# Altium schematic sheet LoRaWAN.SchDoc
size A3
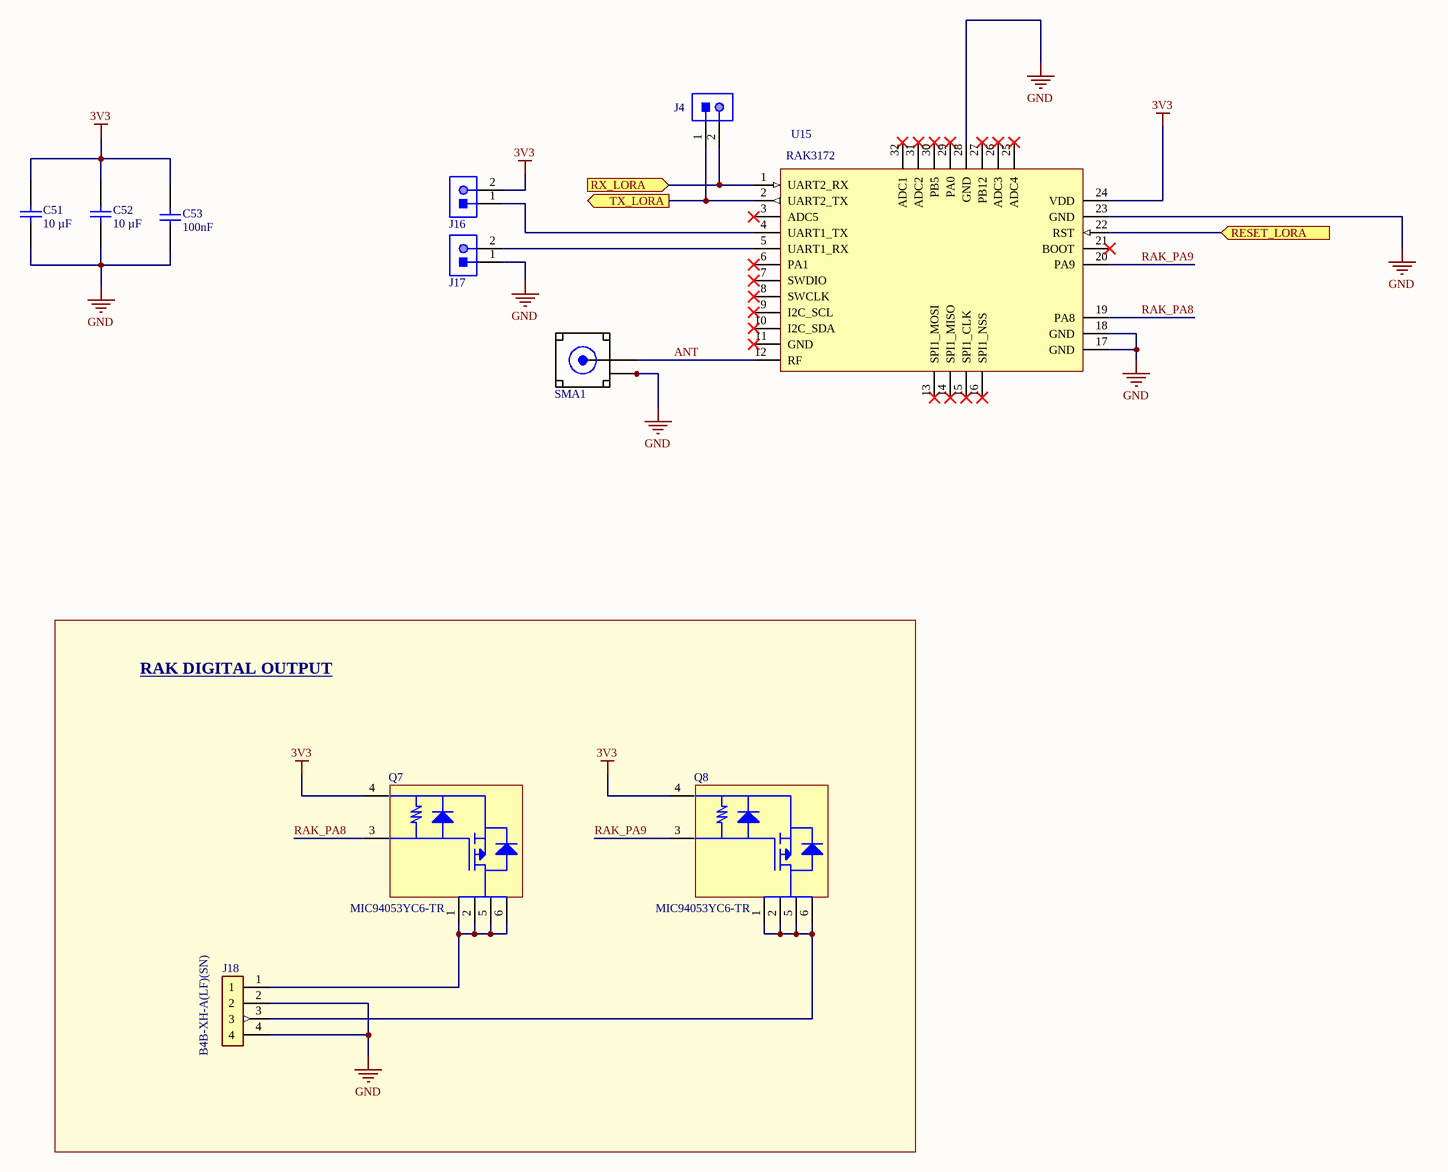
[diagram p0: LoRaWAN.SchDoc]

## Parts
C51  10 µF  [Cap 0805 (2012 Metric)]
C52  10 µF  [Cap 0805 (2012 Metric)]
C53  100nF  [Cap 0805 (2012 Metric)]
J4  Header 2x1  [Header 2x1]  (value not drawn)
J16  Header 2x1  [Header 2x1]  (value not drawn)
J17  Header 2x1  [Header 2x1]  (value not drawn)
J18  B4B-XH-A(LF)(SN)  [B4B-XH-A(LF)(SN)]
Q7  MIC94053YC6-TR  [SC-70-6]
Q8  MIC94053YC6-TR  [SC-70-6]
SMA1  https://www.digikey.com/products/en?keywords=5-1814400-1  [5-1814400-1+ant]  (value not drawn)
U15  RAK3172  [RAK3172]

## Blocks framed on the sheet
RAK DIGITAL OUTPUT: J18 Q7 Q8

## Ports
RESET_LORA (in), RX_LORA (in), TX_LORA (out)

## Nets
3V3: C51.1 C52.1 C53.1 J16.2 Q7.4(S) Q8.4(S) U15.24(VDD)
GND: C51.2 C52.2 C53.2 J17.1 J18.2 J18.4 SMA1.1(GND) SMA1.2(GND) SMA1.3(GND) SMA1.4(GND) U15.17(GND) U15.18(GND) U15.23(GND) U15.28(GND)
ANT: SMA1.5(SIGNAL) U15.12(RF)
RAK_PA8: Q7.3(G) U15.19(PA8)
RAK_PA9: Q8.3(G) U15.20(PA9)
RESET_LORA: U15.22(RST) ; port RESET_LORA
RX_LORA: J4.2 U15.1(UART2_RX) ; port RX_LORA
TX_LORA: J4.1 U15.2(UART2_TX) ; port TX_LORA
NetJ16_1: J16.1 U15.4(UART1_TX)
NetJ17_2: J17.2 U15.5(UART1_RX)
NetJ18_1: J18.1 Q7.1(D) Q7.2(D) Q7.5(D) Q7.6(D)
NetJ18_3: J18.3 Q8.1(D) Q8.2(D) Q8.5(D) Q8.6(D)

Not connected (* = marked no-connect by the designer): U15 3(ADC5)* 6(PA1)* 7(SWDIO)* 8(SWCLK)* 9(I2C_SCL)* 10(I2C_SDA)* 11(GND)* 13(SPI1_MOSI)* 14(SPI1_MISO)* 15(SPI1_CLK)* 16(SPI1_NSS)* 21(BOOT)* 25(ADC4)* 26(ADC3)* 27(PB12)* 29(PA0)* 30(PB5)* 31(ADC2)* 32(ADC1)*

## Library data of the parts
C51 C52 = Capacitor: 10 µF ±10% 10V Ceramic Capacitor X5R 0805 (2012 Metric); Manufacturer: Cal-Chip Electronics; Manufacturer Part Number: GMC21X5R106K10NT; Link: https://www.digikey.com/en/products/detail/cal-chip-electronics-inc/GMC21X5R106K10NT/13970195; Supplier 1: Digi-Key; Supplier Part Number 1: 66925-507LF-ND; RoHS: Yes; Capacitance: 10 µF
C53 = Capacitor: Cap Ceramic 0.1uF 50V X7R 10% Pad SMD 0805 125C Automotive T/R; Manufacturer: Samsung; Manufacturer Part Number: CL21B104KBC5PNL; Link: https://www.digikey.com/es/products/detail/samsung-electro-mechanics/CL21B104KBC5PNL/7320505?s=N4IgTCBcDaIMIBkwEYBCyAMAWA0quArAAoByCIAugL5A; Supplier 1: Digi-Key; Supplier Part Number 1: 1276-7000-1-ND; RoHS: Yes; Category: Ceramic Capacitors; Stock 1: 163447; Pricing 1: 1=0,26000, 10=0,18000, 50=0,10820, 100=0,09140, 500=0,06254, 1000=0,05533, 2500=0,05292, 5000=0,04811 (USD); Mount: Surface Mount; Case/Package: 0805; Min Operating Temperature: -55°C; Max Operating Temperature: 125°C; Capacitance: 100nF; Tolerance: 10%; Dielectric: X7R; Packaging: Tape and Reel; Voltage: 50V; Series: CL; Length: 2mm; Height: 0.85mm; Depth: 1.25mm; Radiation Hardening: No; ComponentLink1URL: https://datasheet.ciiva.com/15195/getdatasheetpartid-359581-15195873.pdf?src-supplier=Verical; ComponentLink1Description: https://datasheet.ciiva.com/15195/getdatasheetpartid-359581-15195873.pdf?src-supplier=Verical
J18 = B4B-XH-A(LF)(SN): JST (JAPAN SOLDERLESS TERMINALS) - B4B-XH-A (LF)(SN) - Wire-To-Board Connector, Vertical, 2.5 mm, 4 Contacts, Header, XH Series, Through Hole, 1 Rows; Insulation Resistance: 1GR; Current Rating: 3A; Contact Resistance: 20mR; Gender: Male; Number of Positions: 4; Max Voltage Rating (AC): 250V; Connector Type: Male Pin; Pitch: 2.5mm; Wire/Cable Gauge: 22AWG; Supplier 1: Arrow Electronics; Manufacturer: JST; RoHS: Yes; Category: FFC / FPC; Mount: Through Hole; Contact Plating: Tin,Copper,Lead; Contact Material: Brass; Color: Natural; Housing Material: Polyamide; Housing Color: White; Material: Polyamide; Min Operating Temperature: -25°C; Max Operating Temperature: 85°C; Termination: Press-Fit; Series: XH; Number of Rows: 1; Packaging: Bulk; Orientation: Straight; Max Current Rating: 3A; Package Quantity: 500; Number of Contacts: 4; Contact Type: Male Pin; Voltage Rating (AC): 250V; Voltage Rating: 250V; Max Voltage Rating (DC): 250V; Length: 12.4mm; Depth: 5.75mm; Lead Pitch: 2.5mm; REACH SVHC: No SVHC; Lead Free: Lead Free; ComponentLink1URL: https://datasheet.ciiva.com/26894/getdatasheetpartid-455616-26894787.pdf?src-supplier=Verical; ComponentLink1Description: https://datasheet.ciiva.com/26894/getdatasheetpartid-455616-26894787.pdf?src-supplier=Verical; ComponentLink2URL: https://datasheet.ciiva.com/16203/b4b-xh-alfsn-16203642.pdf?src-supplier=Future+Electronics; ComponentLink2Description: https://datasheet.ciiva.com/16203/b4b-xh-alfsn-16203642.pdf?src-supplier=Future+Electronics; ComponentLink3URL: https://datasheet.ciiva.com/26924/getdatasheetpartid-640571-26924035.pdf?src-supplier=Verical; ComponentLink3Description: https://datasheet.ciiva.com/26924/getdatasheetpartid-640571-26924035.pdf?src-supplier=Verical; ComponentLink4URL: https://datasheet.ciiva.com/726/exh-726404.pdf?src-supplier=Digi-Key; ComponentLink4Description: https://datasheet.ciiva.com/726/exh-726404.pdf?src-supplier=Digi-Key; Manufacturer Part Number: B4B-XH-A(LF)(SN); Supplier Part Number 1: B4B-XH-A (LF)(SN); Link: https://www.digikey.com/es/products/detail/jst-sales-america-inc/B4B-XH-A-LF-SN/1651047?s=N4IgTCBcDaIEIBY4FoAaAJZBBAFAGQDEBKHAZQDkiQBdAXyA
Q7 Q8 = TransistorMosfet(Load): P-Channel 6V 2A (Ta) 270mW (Ta) Surface Mount SC-70-6; Manufacturer: Microchip; Link: https://www.digikey.com/product-detail/en/microchip-technology/MIC94053YC6-TR/576-2939-1-ND/1822099; Supplier 1: Digi-Key; Supplier Part Number 1: 576-2939-1-ND; Manufacturer Part Number: MIC94053YC6-TR; RoHS: Yes; Category: MOSFETs; Stock 1: 3005; Pricing 1: 1=0,58000, 25=0,48000, 100=0,46250 (USD); ComponentLink1URL: https://datasheet.ciiva.com/6379/mic94052-53-6379193.pdf?src-supplier=Digi-Key; ComponentLink1Description: https://datasheet.ciiva.com/6379/mic94052-53-6379193.pdf?src-supplier=Digi-Key; ComponentLink2URL: https://datasheet.ciiva.com/6379/mic94052-53-6379189.pdf?src-supplier=Digi-Key; ComponentLink2Description: https://datasheet.ciiva.com/6379/mic94052-53-6379189.pdf?src-supplier=Digi-Key; ComponentLink3URL: https://datasheet.ciiva.com/46408/264781-46408581.pdf?src-supplier=Element14; ComponentLink3Description: https://datasheet.ciiva.com/46408/264781-46408581.pdf?src-supplier=Element14; ComponentLink4URL: https://datasheet.ciiva.com/15200/getdatasheetpartid-111629-15200795.pdf?src-supplier=Verical; ComponentLink4Description: https://datasheet.ciiva.com/15200/getdatasheetpartid-111629-15200795.pdf?src-supplier=Verical
SMA1 = 5-1814400-1: CONN SMA JACK R/A 50 OHM PCB; Manufacturer: AMP - TE CONNECTIVITY; Supplier 1: Digi-Key; Manufacturer Part Number: 5-1814400-1; Stock 1: 16359; Pricing 1: 1=2,61000, 10=2,50400, 25=2,29560, 50=2,19120, 100=2,08690, 250=1,82604, 500=1,77386, 1000=1,51300, 2500=1,40866 (USD); RoHS: No; ComponentLink1URL: http://www.farnell.com/datasheets/1803168.pdf?src-supplier=Farnell; ComponentLink1Description: http://www.farnell.com/datasheets/1803168.pdf?src-supplier=Farnell; ComponentLink2URL: https://www.te.com/commerce/DocumentDelivery/DDEController?Action=srchrtrv&DocNm=1814400&DocType=Customer+Drawing&DocLang=English&src-supplier=Digi-Key; ComponentLink2Description: https://www.te.com/commerce/DocumentDelivery/DDEController?Action=srchrtrv&DocNm=1814400&DocType=Customer+Drawing&DocLang=English&src-supplier=Digi-Key; ComponentLink3URL: http://www.farnell.com/datasheets/1803168.pdf?src-supplier=Newark; ComponentLink3Description: http://www.farnell.com/datasheets/1803168.pdf?src-supplier=Newark; Supplier Part Number 1: A97593-ND; Link: https://www.digikey.com/es/products/detail/te-connectivity-amp-connectors/5-1814400-1/1755981?s=N4IgTCBcDaIKwFoCMAOJAWdAGLyQF0BfIA
U15 = RAK3172: RAK3172 WisDuo LPWAN Module; Manufacturer: RAK; Manufacturer Part Number: RAK3172; Link: https://store.rakwireless.com/products/wisduo-lpwan-module-rak3172?variant=40014759395526